# Altium schematic sheet CameraInterface.SchDoc
size A
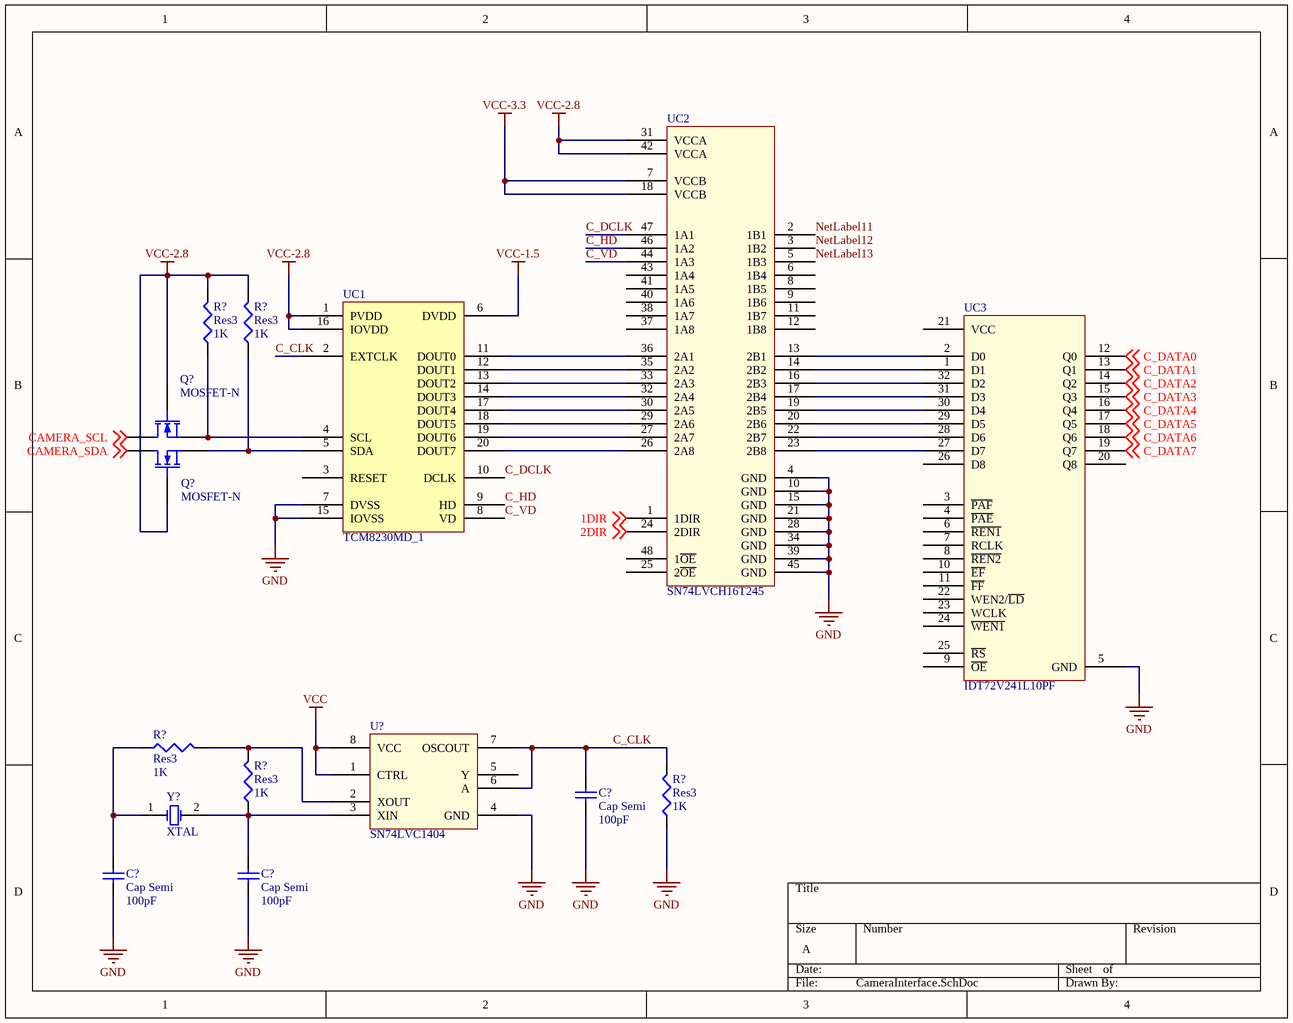
[diagram p0: CameraInterface.SchDoc]

## Parts
(Parts that share a designator on the sheet are numbered #1, #2 ... from top to bottom, then left to right.)
C?#1  Cap Semi  value 100pF  [CAPC1608L]
C?#2  Cap Semi  value 100pF  [CAPC1608L]
C?#3  Cap Semi  value 100pF  [CAPC1608L]
Q?#1  MOSFET-N  [BCY-W3/B.8]
Q?#2  MOSFET-N  [BCY-W3/B.8]
R?#1  Res3  value 1K  [RESC1608L]
R?#2  Res3  value 1K  [RESC1608L]
R?#3  Res3  value 1K  [RESC1608L]
R?#4  Res3  value 1K  [RESC1608L]
R?#5  Res3  value 1K  [RESC1608L]
U?  SN74LVC1404
UC1  TCM8230MD_1  [TCM8230MD]
UC2  SN74LVCH16T245
UC3  IDT72V241L10PF
Y?  XTAL  [BCY-W2/D3.1]

## Nets
GND: C?#1.1 C?#2.1 C?#3.1 R?#5.1 U?.4(GND) UC1.7(DVSS) UC1.15(IOVSS) UC2.4(GND) UC2.10(GND) UC2.15(GND) UC2.21(GND) UC2.28(GND) UC2.34(GND) UC2.39(GND) UC2.45(GND) UC3.5(GND)
VCC: U?.1(CTRL) U?.8(VCC)
VCC-1.5: UC1.6(DVDD)
VCC-2.8: Q?#1.2(G) Q?#2.2(G) R?#1.2 R?#2.2 UC1.1(PVDD) UC1.16(IOVDD) UC2.31(VCCA) UC2.42(VCCA)
VCC-3.3: UC2.7(VCCB) UC2.18(VCCB)
1DIR: UC2.1(1DIR) ; off-sheet 1DIR
2DIR: UC2.24(2DIR) ; off-sheet 2DIR
C_CLK: C?#1.2 R?#5.2 U?.6(A) U?.7(OSCOUT) UC1.2(EXTCLK)
C_DATA0: UC3.12(Q0) ; off-sheet C_DATA0
C_DATA1: UC3.13(Q1) ; off-sheet C_DATA1
C_DATA2: UC3.14(Q2) ; off-sheet C_DATA2
C_DATA3: UC3.15(Q3) ; off-sheet C_DATA3
C_DATA4: UC3.16(Q4) ; off-sheet C_DATA4
C_DATA5: UC3.17(Q5) ; off-sheet C_DATA5
C_DATA6: UC3.18(Q6) ; off-sheet C_DATA6
C_DATA7: UC3.19(Q7) ; off-sheet C_DATA7
C_DCLK: UC1.10(DCLK) UC2.47(1A1)
C_HD: UC1.9(HD) UC2.46(1A2)
C_VD: UC1.8(VD) UC2.44(1A3)
CAMERA_SCL: Q?#1.1(D) ; off-sheet CAMERA_SCL
CAMERA_SDA: Q?#2.1(D) ; off-sheet CAMERA_SDA
NetLabel11: UC2.2(1B1)
NetLabel12: UC2.3(1B2)
NetLabel13: UC2.5(1B3)
NetC?#2_2: C?#2.2 R?#3.1 Y?.1(OSC1)
NetC?#3_2: C?#3.2 R?#4.1 U?.3(XIN) Y?.2(OSC2)
NetQ?#1_3: Q?#1.3(S) R?#1.1 UC1.4(SCL)
NetQ?#2_3: Q?#2.3(S) R?#2.1 UC1.5(SDA)
NetR?#3_2: R?#3.2 R?#4.2 U?.2(XOUT)
NetUC1_11: UC1.11(DOUT0) UC2.36(2A1)
NetUC1_12: UC1.12(DOUT1) UC2.35(2A2)
NetUC1_13: UC1.13(DOUT2) UC2.33(2A3)
NetUC1_14: UC1.14(DOUT3) UC2.32(2A4)
NetUC1_17: UC1.17(DOUT4) UC2.30(2A5)
NetUC1_18: UC1.18(DOUT5) UC2.29(2A6)
NetUC1_19: UC1.19(DOUT6) UC2.27(2A7)
NetUC1_20: UC1.20(DOUT7) UC2.26(2A8)
NetUC2_13: UC2.13(2B1) UC3.2(D0)
NetUC2_14: UC2.14(2B2) UC3.1(D1)
NetUC2_16: UC2.16(2B3) UC3.32(D2)
NetUC2_17: UC2.17(2B4) UC3.31(D3)
NetUC2_19: UC2.19(2B5) UC3.30(D4)
NetUC2_20: UC2.20(2B6) UC3.29(D5)
NetUC2_22: UC2.22(2B7) UC3.28(D6)
NetUC2_23: UC2.23(2B8) UC3.27(D7)

Not connected (* = marked no-connect by the designer): U? 5(Y); UC1 3(RESET); UC2 6(1B4) 8(1B5) 9(1B6) 11(1B7) 12(1B8) 25(2~{OE}) 37(1A8) 38(1A7) 40(1A6) 41(1A5) 43(1A4) 48(1~{OE}); UC3 3(~{PAF}) 4(~{PAE}) 6(~{REN1}) 7(RCLK) 8(~{REN2}) 9(~{OE}) 10(~{EF}) 11(~{FF}) 20(Q8) 21(VCC) 22(WEN2/~{LD}) 23(WCLK) 24(~{WEN1}) 25(~{RS}) 26(D8)

## Library data of the parts
C?#1-C?#3 = Cap Semi: Capacitor (Semiconductor SIM Model); Published: 8-Jun-2000; LatestRevisionDate: 29-May-2009; LatestRevisionNote: IPC-7351 Footprint Added.; PackageReference: C1206; Publisher: Altium Limited; PackageDescription: Chip Capacitor
Q?#1 Q?#2 = MOSFET-N: N-Channel MOSFET; Published: 8-Jun-2000; LatestRevisionDate: 17-Jul-2002; LatestRevisionNote: Re-released for DXP Platform.; PackageVersion: 1995/1996; PackageReference: E3; Publisher: Altium Limited
R?#1-R?#5 = Res3: Resistor; Published: 8-Jun-2000; LatestRevisionDate: 29-May-2009; LatestRevisionNote: IPC-7351 Footprint Added.; PackageReference: J1-0603; Publisher: Altium Limited; PackageDescription: Chip Resistor
U? = SN74LVC1404: Oscillator driver.
UC1 = TCM8230MD_1: VGA CAMERA MODULE 640x480
UC2 = SN74LVCH16T245: 16-bit bus transceiver with voltage regulation.
UC3 = IDT72V241L10PF: 36K (4K x 9) FIFO Buffer
Y? = XTAL: Crystal Oscillator; Published: 8-Jun-2000; LatestRevisionDate: 17-Jul-2002; LatestRevisionNote: Re-released for DXP Platform.; PackageReference: R38; Publisher: Altium Limited